# Altium schematic sheet motordriverschematic.SchDoc
size C; SheetNumber: 1; SheetTotal: 1
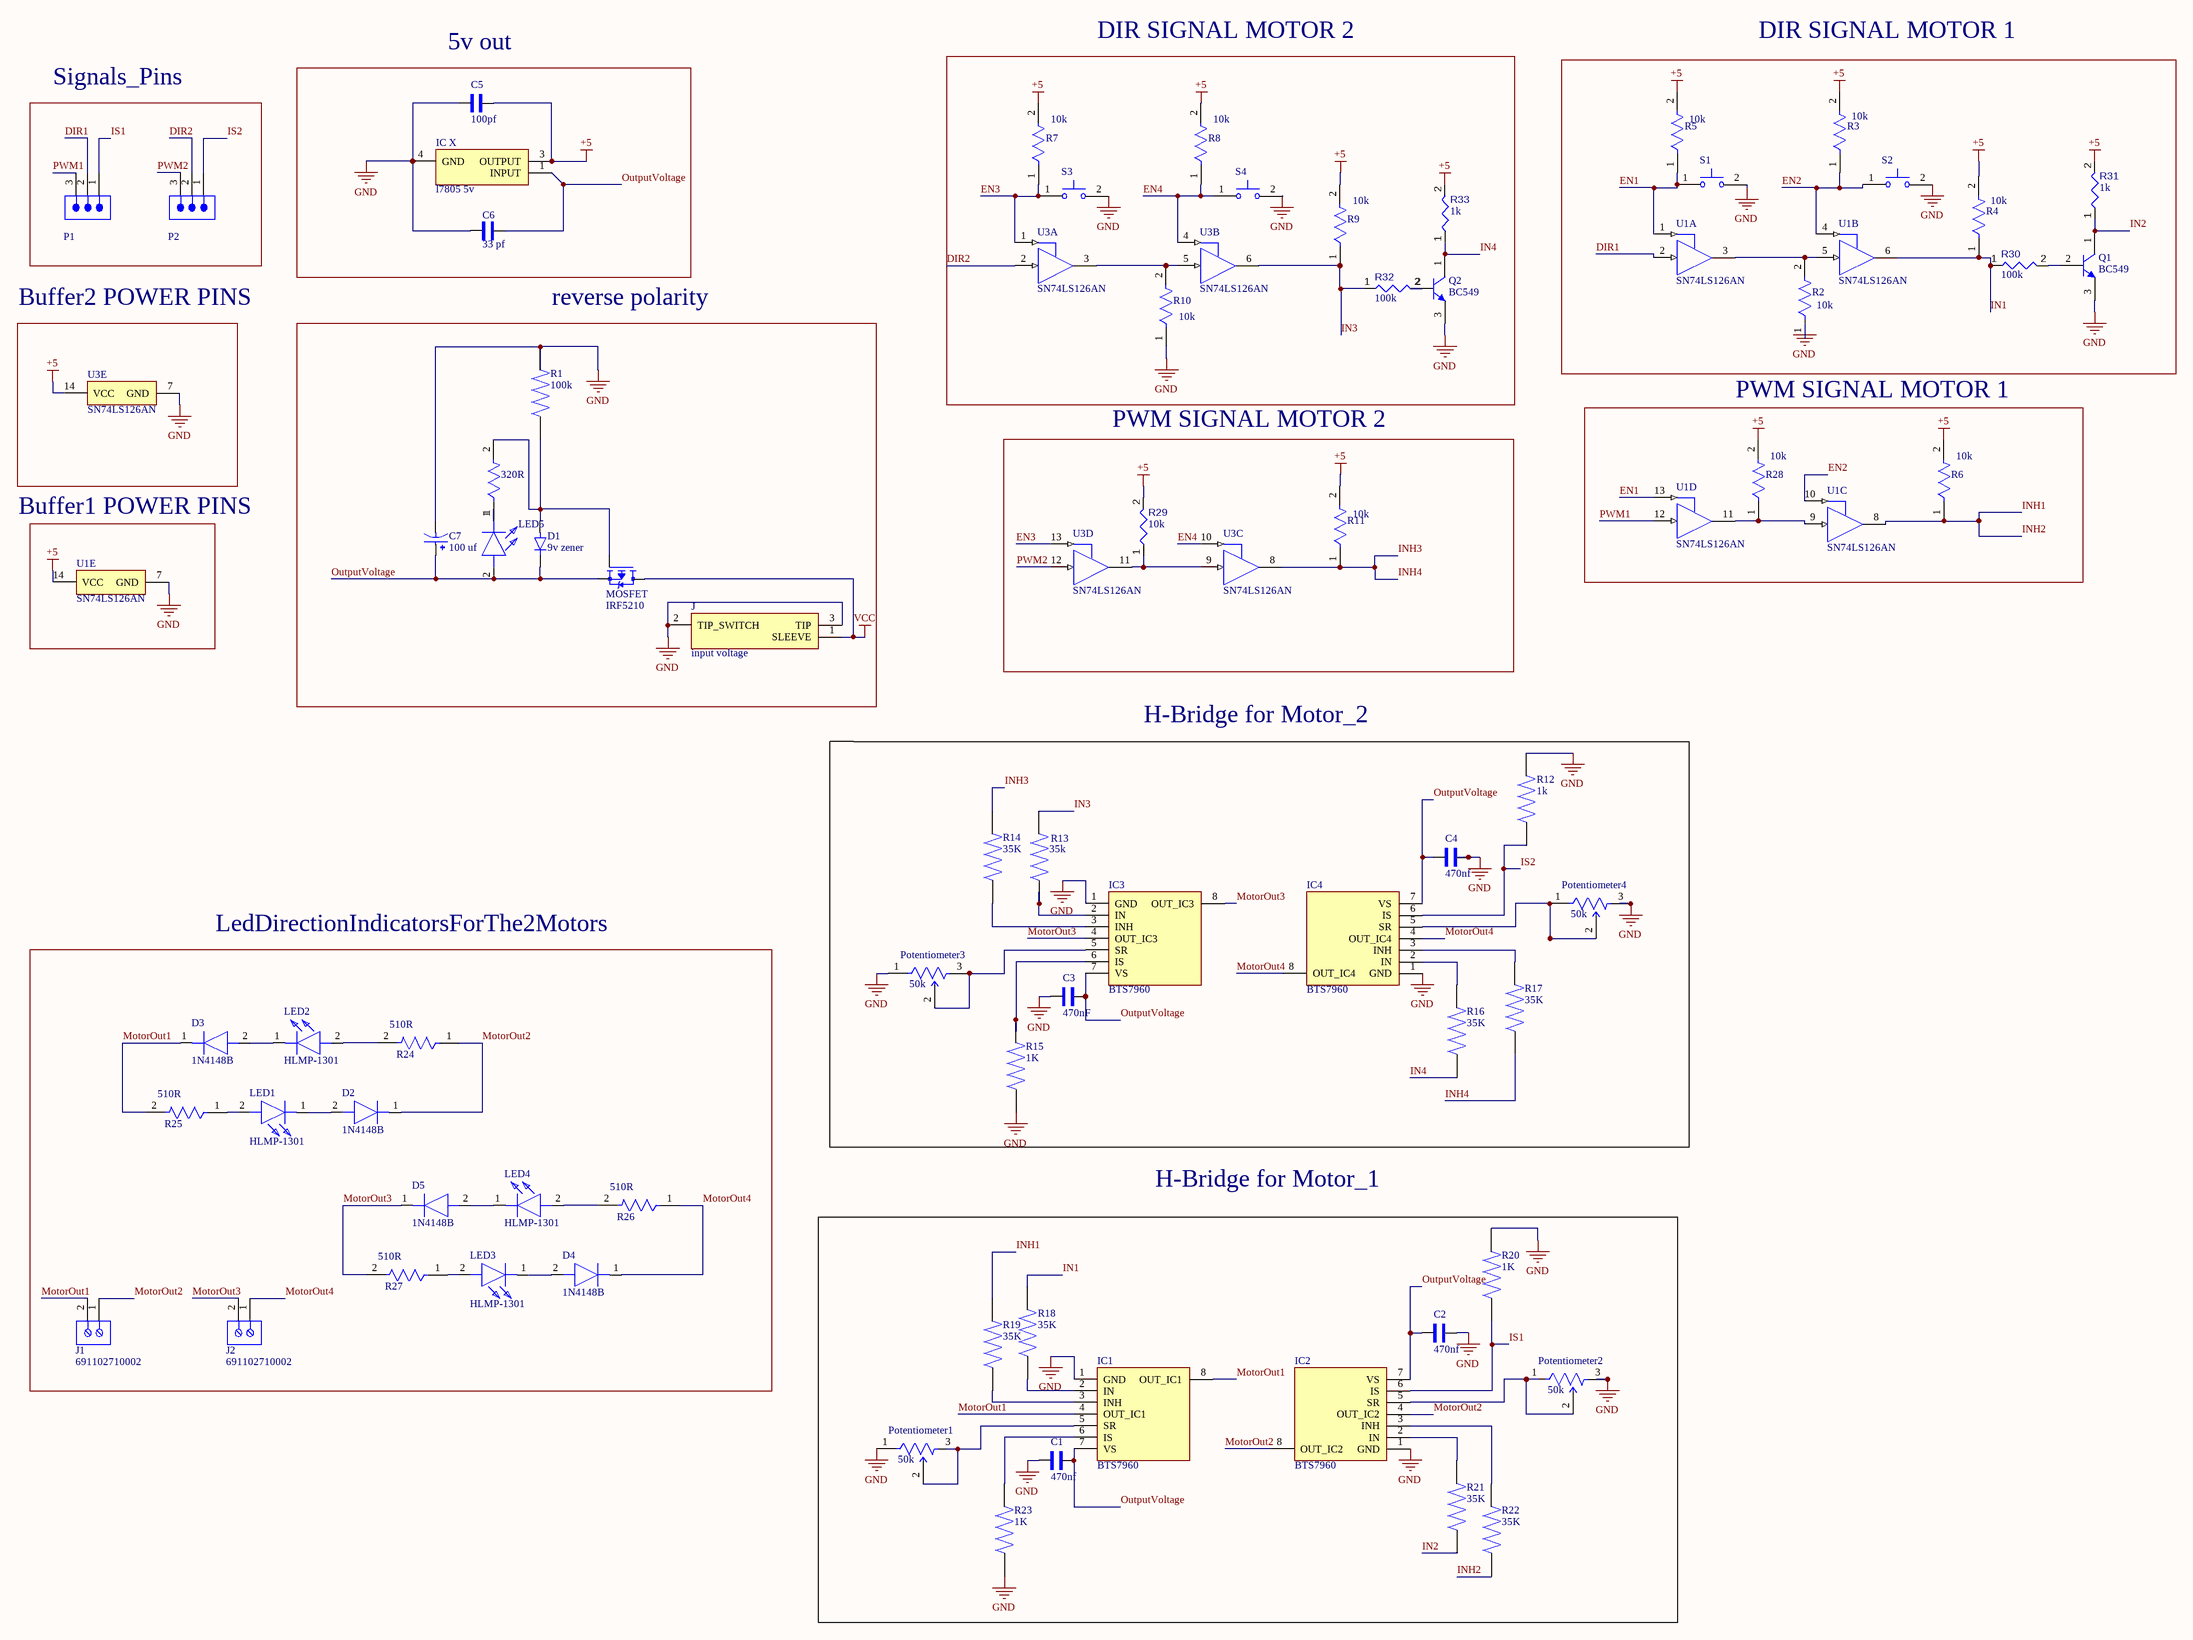
[diagram p0: motordriverschematic.SchDoc]

## Parts
320R  CF18JT10K0  [10k resistor]  (value not drawn)
C1  470nf  [CAPRR254W54L381T254H466]
C2  470nf  [CAPRR254W54L381T254H466]
C3  470nF  [CAPRR254W54L381T254H466]
C4  470nf  [CAPRR254W54L381T254H466]
C5  100pf  [CAPRR254W54L381T254H466]
C6  33 pf  [CAPRR254W54L381T254H466]
C7  100 uf  [CAPPRD750W80D1600H2000]
D1  9v zener  [DIOAD780W78L463D236]
D2  1N4148B  [DIOAD990W55L340D162]
D3  1N4148B  [DIOAD990W55L340D162]
D4  1N4148B  [DIOAD990W55L340D162]
D5  1N4148B  [DIOAD990W55L340D162]
IC1  BTS7960  [BTS7960B]
IC2  BTS7960  [BTS7960B]
IC3  BTS7960  [BTS7960B]
IC4  BTS7960  [BTS7960B]
IC_X  l7805 5v  [D2PAK-STB35NF10T4]
J  input voltage  [FC681465P]
J1  691102710002  [691102710002]
J2  691102710002  [691102710002]
LED1  HLMP-1301  [HLMP1301]
LED2  HLMP-1301  [HLMP1301]
LED3  HLMP-1301  [HLMP1301]
LED4  HLMP-1301  [HLMP1301]
LED5  HLMP-1301  [HLMP1301]  (value not drawn)
MOSFET  IRF5210  [TO254P1054X469X2933-3]
P1  691311700103  [691311700103]  (value not drawn)
P2  691311700103  [691311700103]  (value not drawn)
Potentiometer1  50k  [FP-3362U-MFG]
Potentiometer2  50k  [FP-3362U-MFG]
Potentiometer3  50k  [FP-3362U-MFG]
Potentiometer4  50k  [FP-3362U-MFG]
Q1  BC549  [ONSC-TO-92-3-29-04_AD]
Q2  BC549  [ONSC-TO-92-3-29-04_AD]
R1  100k  [RESAD1100W55L680D260]
R2  10k  [10k resistor]
R3  10k  [10k resistor]
R4  10k  [10k resistor]
R5  10k  [10k resistor]
R6  10k  [10k resistor]
R7  10k  [10k resistor]
R8  10k  [10k resistor]
R9  10k  [10k resistor]
R10  10k  [10k resistor]
R11  10k  [10k resistor]
R12  1k  [RESAD1100W55L680D260]
R13  35k  [RESAD1100W55L680D260]
R14  35K  [RESAD1100W55L680D260]
R15  1K  [RESAD1100W55L680D260]
R16  35K  [RESAD1100W55L680D260]
R17  35K  [RESAD1100W55L680D260]
R18  35K  [RESAD1100W55L680D260]
R19  35K  [RESAD1100W55L680D260]
R20  1K  [RESAD1100W55L680D260]
R21  35K  [RESAD1100W55L680D260]
R22  35K  [RESAD1100W55L680D260]
R23  1K  [RESAD1100W55L680D260]
R24  510R  [10k resistor]
R25  510R  [10k resistor]
R26  510R  [10k resistor]
R27  510R  [10k resistor]
R28  10k  [RESAD1100W55L680D260]
R29  value 10k  [RESA60-630X240]  (hidden comment: MFR-25FBF52-22K1)
R30  value 100k  [RESA60-630X240]  (hidden comment: MFR-25FBF52-2K21)
R31  value 1k  [RESA60-630X240]  (hidden comment: MFR-25FBF52-2K21)
R32  value 100k  [RESA60-630X240]  (hidden comment: MFR-25FBF52-2K21)
R33  value 1k  [RESA60-630X240]  (hidden comment: MFR-25FBF52-2K21)
S1  BUTT-2  [SW_BUTT-2]  (value not drawn)
S2  BUTT-2  [SW_BUTT-2]  (value not drawn)
S3  BUTT-2  [SW_BUTT-2]  (value not drawn)
S4  BUTT-2  [SW_BUTT-2]  (value not drawn)
U1  SN74LS126AN  [3-stateBuffer]  (parts A,B,C,D,E of 5)
U3  SN74LS126AN  [3-stateBuffer]  (parts A,B,C,D,E of 5)

## Blocks framed on the sheet
5v out: C5 C6 IC_X
DIR SIGNAL MOTOR 2: Q2 R7-R10 R32 R33 S3 S4 U3
DIR SIGNAL MOTOR 1: Q1 R2-R5 R30 R31 S1 S2 U1
Signals_Pins: P1 P2
Buffer2 POWER PINS: U3
reverse polarity: 320R C7 D1 J LED5 MOSFET R1
PWM SIGNAL MOTOR 2: R11 R29 U3
PWM SIGNAL MOTOR 1: R6 R28 U1
H-Bridge for Motor_2: C3 C4 IC3 IC4 Potentiometer3 Potentiometer4 R12-R17
LedDirectionIndicatorsForThe2Motors: D2-D5 J1 J2 LED1-LED4 R24-R27

## Nets
+5: C5.2 IC_X.3(OUTPUT) R3.2 R4.2 R5.2 R6.2 R7.2 R8.2 R9.2 R11.2 R28.2 R29.2 R31.2 R33.2 U1.14(VCC) U3.14(VCC)
GND: C1.1 C2.2 C3.1 C4.2 C5.1 C6.2 C7.N IC1.1(GND) IC2.1(GND) IC3.1(GND) IC4.1(GND) IC_X.4(GND) J.2(TIP_SWITCH) J.3(TIP) Potentiometer1.1(CCW) Potentiometer2.3(CW) Potentiometer3.1(CCW) Potentiometer4.3(CW) Q1.3(E) Q2.3(E) R1.2 R2.1 R10.1 R12.2 R15.1 R20.2 R23.1 S1.2 S2.2 S3.2 S4.2 U1.7(GND) U3.7(GND)
VCC: J.1(SLEEVE) MOSFET.2(D)
DIR1: P1.2 U1.2(1A)
DIR2: P2.2 U3.2(1A)
EN1: R5.1 S1.1 U1.1(1G) U1.13(4G)
EN2: R3.1 S2.1 U1.4(2G) U1.10(3G)
EN3: R7.1 S3.1 U3.1(1G) U3.13(4G)
EN4: R8.1 S4.1 U3.4(2G) U3.10(3G)
IN1: R4.1 R18.2 R30.1 U1.6(2Y)
IN2: Q1.1(C) R21.1 R31.1
IN3: R9.1 R13.2 R32.1 U3.6(2Y)
IN4: Q2.1(C) R16.1 R33.1
INH1: R6.1 R19.2 R22.1 U1.8(3Y)  [also labelled INH2]
INH3: R11.1 R14.2 R17.1 U3.8(3Y)  [also labelled INH4]
IS1: IC2.6(IS) P1.1 R20.1
IS2: IC4.6(IS) P2.1 R12.1
MotorOut1: D3.1(K) IC1.4(OUT_IC1) IC1.8(OUT_IC1) J1.2 R25.2
MotorOut2: D2.1(K) IC2.4(OUT_IC2) IC2.8(OUT_IC2) J1.1 R24.1
MotorOut3: D5.1(K) IC3.4(OUT_IC3) IC3.8(OUT_IC3) J2.2 R27.2
MotorOut4: D4.1(K) IC4.4(OUT_IC4) IC4.8(OUT_IC4) J2.1 R26.1
OutputVoltage: C1.2 C2.1 C3.2 C4.1 C6.1 C7.P D1.K IC1.7(VS) IC2.7(VS) IC3.7(VS) IC4.7(VS) IC_X.1(INPUT) LED5.2(A) MOSFET.3(S)
PWM1: P1.3 U1.12(4A)
PWM2: P2.3 U3.12(4A)
Net320R_1: 320R.1 LED5.1(K)
Net320R_2: 320R.2 D1.A MOSFET.1(G) R1.1
NetD2_2: D2.2(A) LED1.1(K)
NetD3_2: D3.2(A) LED2.1(K)
NetD4_2: D4.2(A) LED3.1(K)
NetD5_2: D5.2(A) LED4.1(K)
NetIC1_2: IC1.2(IN) R18.1
NetIC1_3: IC1.3(INH) R19.1
NetIC1_5: IC1.5(SR) Potentiometer1.2(WIPER) Potentiometer1.3(CW)
NetIC1_6: IC1.6(IS) R23.2
NetIC2_2: IC2.2(IN) R21.2
NetIC2_3: IC2.3(INH) R22.2
NetIC2_5: IC2.5(SR) Potentiometer2.1(CCW) Potentiometer2.2(WIPER)
NetIC3_2: IC3.2(IN) R13.1
NetIC3_3: IC3.3(INH) R14.1
NetIC3_5: IC3.5(SR) Potentiometer3.2(WIPER) Potentiometer3.3(CW)
NetIC3_6: IC3.6(IS) R15.2
NetIC4_2: IC4.2(IN) R16.2
NetIC4_3: IC4.3(INH) R17.2
NetIC4_5: IC4.5(SR) Potentiometer4.1(CCW) Potentiometer4.2(WIPER)
NetLED1_2: LED1.2(A) R25.1
NetLED2_2: LED2.2(A) R24.2
NetLED3_2: LED3.2(A) R27.1
NetLED4_2: LED4.2(A) R26.2
NetQ1_2: Q1.2(B) R30.2
NetQ2_2: Q2.2(B) R32.2
NetR2_2: R2.2 U1.3(1Y) U1.5(2A)
NetR10_2: R10.2 U3.3(1Y) U3.5(2A)
NetR28_1: R28.1 U1.9(3A) U1.11(4Y)
NetR29_1: R29.1 U3.9(3A) U3.11(4Y)

## Notes on the sheet
- Buffer1 POWER PINS
- H-Bridge for Motor_1

## Library data of the parts
320R = CMP-26528-000002-1: RES 10K OHM 1/8W 5% CF AXIAL; Manufacturer: Stackpole Electronics; Power Rating: 0.125W; Temperature Coefficient: 0-500ppm/°C; Resistance: 10kΩ; Voltage Rating: 250V; Value: 10kΩ; Temperature: -55°C to +155°C; Height: 2mm; Lead Free: Yes; Automotive: No; Device Class L2: Resistors; Package: CF18; Series: CF; ComponentLink2Description: Datasheet; Ipc Land Pattern Name: RESAD656W65L360D200; Manufacturer Part Number: CF18JT10K0; Temperature Range High: +155°C; RoHS: TRUE; Device Class L3: Through-Hole Resistors; Temperature Range Low: -55°C; Device Class L1: Passive Components; Category: Res; Octopart: https://octopart.com/cf18jt10k0-stackpole+electronics-19205642; Composition: Carbon Film; Digikey Description: RES 10K OHM 1/8W 5% CF AXIAL; ComponentLink2URL: http://www.seielect.com/Catalog/SEI-CF_CFM.pdf; Tolerance: 5%
C1-C6 = C315C470J1G5TA: Capacitor: ceramic; MLCC, monolithic; 47pF; 100V; C0G; Â±5%; THT; MF: KEMET; SnapEDA_Link: https://www.snapeda.com/parts/C315C470J1G5TA/KEMET/view-part/?ref=snap; Package: Radial Kemet; Value: *; MP: C315C470J1G5TA; Check_prices: https://www.snapeda.com/parts/C315C470J1G5TA/KEMET/view-part/?ref=eda
C7 = EEUFS1J681S: CAP ALUM 680UF 20% 63V THRU HOLE; MP: EEU-FS1J681S; MF: Panasonic Electronic Components; Package: RADIAL-2 Panasonic; Availability: In Stock; SnapEDA_Link: https://www.snapeda.com/parts/EEU-FS1J681S/Panasonic/view-part/5562022/?ref=snap; Price: None; Check_prices: https://www.snapeda.com/parts/EEU-FS1J681S/Panasonic/view-part/5562022/?ref=eda; Value: *
D1 = 1N4007-T: Diode Standard 1A 1000V 1Vf DO41 | Diodes Inc 1N4007-T; MF: Diodes Incorporated; SnapEDA_Link: https://www.snapeda.com/parts/1N4007-T/Diodes+Inc./view-part/?ref=snap; Package: DO-41 Diodes Inc.; Value: *; MP: 1N4007-T; Check_prices: https://www.snapeda.com/parts/1N4007-T/Diodes+Inc./view-part/?ref=eda
D2-D5 = 1N4148B: Diode; Manufacturer_Name: Vishay; Datasheet Link: https://www.vishay.com/docs/81857/1n4148.pdf; Manufacturer_Part_Number: 1N4148B
IC1-IC4 = BTS7960BNTMA1: Integrated Circuit; Manufacturer_Name: Infineon; Datasheet Link: https://www.mouser.co.uk/ProductDetail/Infineon-Technologies/BTS7960BNTMA1?qs=3%2FhYFTG7CVfEx3XLwpC3gw==; Height: 4.4mm; Manufacturer_Part_Number: BTS7960BNTMA1; Mouser Part Number: N/A; Mouser Price/Stock: https://www.mouser.co.uk/ProductDetail/Infineon-Technologies/BTS7960BNTMA1?qs=3%2FhYFTG7CVfEx3XLwpC3gw%3D%3D
IC_X = L7805ABD2T-TR: Integrated Circuit; Manufacturer_Name: STMicroelectronics; Datasheet Link: https://www.st.com/resource/en/datasheet/l78.pdf; Manufacturer_Part_Number: L7805ABD2T-TR; Mouser Part Number: 511-L7805ABD2T-TR; Mouser Price/Stock: https://www.mouser.co.uk/ProductDetail/STMicroelectronics/L7805ABD2T-TR?qs=LL%252BsqOK9SqOQ%2FfZD5ZsNqA%3D%3D; Arrow Part Number: L7805ABD2T-TR; Arrow Price/Stock: https://www.arrow.com/en/products/l7805abd2t-tr/stmicroelectronics?region=nac
J = FC681465P: Connector; Manufacturer_Name: CLIFF ELECTRONIC COMPONENTS; Datasheet Link: http://www.farnell.com/datasheets/2286781.pdf; Height: 11mm; Manufacturer_Part_Number: FC681465P
J1 J2 = CMP-1502-03258-2: NexarPartId: 8917706; Number of Levels: 1; Number of Positions Per Level: 2; Current: 15A; Voltage: 300V; Pitch: 5.0038mm; Plating: Steel; Stripping Length: -6mm; Wire Gauge (Min): 14AWG; Wire Gauge (Max): 22AWG; Length: 7.5mm; Contact Material: Brass; Contact Plating: Tin; Packaging: Box; Number of Pins: 2; Voltage Rating: 300V; Termination: Screw; Number of Contacts: 2; Color: Blue; Current Rating: 15A; Mount: Through Hole; Max Operating Temperature: 105°C; Min Operating Temperature: -40°C; REACH SVHC: Unknown; Height: 13.4mm; Width: 11.2mm; Housing Material: Nylon; RoHS: Compliant; Wire/Cable Gauge: 22AWG; Lead Pitch: 5mm
  J2: ComponentLink1Description: New link; ComponentLink1URL: *
LED1-LED5 = HLMP-1301: LED; Manufacturer_Name: Avago Technologies; Datasheet Link: https://componentsearchengine.com/Datasheets/2/HLMP-1301.pdf; Height: 6.35mm; Manufacturer_Part_Number: HLMP-1301; Mouser Part Number: 630-HLMP-1301; Mouser Price/Stock: https://www.mouser.co.uk/ProductDetail/Broadcom-Avago/HLMP-1301?qs=jT9z6tsiFNkJAuA0Y2YdzA%3D%3D; Arrow Part Number: HLMP-1301; Arrow Price/Stock: https://www.arrow.com/en/products/hlmp-1301/broadcom-limited
MOSFET = IRF5210: P-Channel 100V 38A _Tc_ 3.1W _Ta_, 170W _Tc_ Surface Mount D2PAK; MF: Infineon Technologies; SnapEDA_Link: https://www.snapeda.com/parts/IRF5210/Infineon%20Technologies/view-part/2777330/?ref=snap; Price: None; MP: IRF5210; Value: *; Availability: Unavailable; Package: TO-220 Infineon Technologies
P1 P2 = CMP-1502-02034-2: NexarPartId: 18818311; Number of Contacts: 3; Connector Type: PCB, Terminal Block; Pitch: 5.0038mm; Current: 20A; Gender: Male; Number of Levels: 1; Voltage: 300V; RoHS: Compliant; Number of Rows: 1; Color: Green; Length: 8.5mm; Number of Positions Per Level: 3; Termination: Solder; Mount: Through Hole; Contact Material: Brass; Lead Pitch: 5mm; Width: 17mm; Number of Pins: 3; Height: 12mm; REACH SVHC: Unknown; Orientation: Vertical; Packaging: Box; Contact Gender: Male
Potentiometer1-Potentiometer4 = CMP-07234-000033-1: TRIMMER 200K OHM 0.5W PC PIN TOP; Max Power Dissipation: 500mW; Temperature Coefficient: 100ppm/°C; Tolerance: 10%; Voltage Rating (DC): 300V; Resistance: 200kR; Package Quantity: 50; Length: 6.6mm; Lead Free: Lead Free; Technology: CERMET; RoHS Compliant: Yes; Max Operating Temperature: 125°C; Military Standard: Not; Packaging: Rail/Tube; Depth: 6.99mm; Mount: Through Hole; Termination: Pin; Color: Blue; Width: 0.26inch; Height: 0.185inch; Taper: Linear; Min Operating Temperature: -55°C; Weight: 0.02oz; Power Rating: 500mW; Series: Trimpot® 3362 - Sealed; Contact Plating: Tin; Resistor Type: Cermet
Q1 Q2 = CMP-1048-01363-1: Low Noise Transistor, NPN Silicon, 3-Pin TO-92, Pb-Free, Bulk Box; Manufacturer: On Semiconductor; PartNumber: BC549CG; IC Continuous (A): 0.1; RoHS: TRUE; Mounting Technology: Through Hole; ComponentLink3URL: http://www.onsemi.com/pub_link/Collateral/BC549B-D.PDF; PackageDescription: 3-Pin Transistor Outline, Body 4.825 x 3.685 mm, Pitch 1.27 mm; DatasheetVersion: Rev. AD; ComponentLink3Description: Package Specification; ComponentLink1URL: http://www.onsemi.com/; PackageVersion: Rev. AD; Polarity: NPN; ComponentLink2Description: Datasheet; ComponentLink1Description: Manufacturer URL; Packing: Bulk Box; ComponentLink2URL: http://www.onsemi.com/pub_link/Collateral/BC549B-D.PDF; PackageReference: TO-92-3-29-04_AD
R1 R12-R23 = MFR-25FBF52-1K: 1.07 kOhms Â±1% 0.25W, 1/4W Through Hole Resistor Axial - Metal Film; MF: Yageo; Value: *; SnapEDA_Link: https://www.snapeda.com/parts/MFR-25FBF52-1K/Yageo/view-part/?ref=snap; Purchase-URL: https://pricing.snapeda.com/search/part/MFR-25FBF52-1K/?ref=eda; Availability: In Stock; Price: None; Package: Axial Yageo; Check_prices: https://www.snapeda.com/parts/MFR-25FBF52-1K/Yageo/view-part/?ref=eda; MP: MFR-25FBF52-1K
R2-R11 R24-R28 = CMP-26528-000002-1: RES 10K OHM 1/8W 5% CF AXIAL; Manufacturer Part Number: CF18JT10K0; Manufacturer: Stackpole Electronics; Power Rating: 0.125W; Temperature Coefficient: 0-500ppm/°C; Resistance: 10kΩ; Voltage Rating: 250V; Value: 10kΩ; Temperature: -55°C to +155°C; Height: 2mm; Lead Free: Yes; Automotive: No; Device Class L2: Resistors; Package: CF18; Series: CF; ComponentLink2Description: Datasheet; Ipc Land Pattern Name: RESAD656W65L360D200; Temperature Range High: +155°C; RoHS: TRUE; Device Class L3: Through-Hole Resistors; Temperature Range Low: -55°C; Device Class L1: Passive Components; Category: Res; Octopart: https://octopart.com/cf18jt10k0-stackpole+electronics-19205642; Composition: Carbon Film; Digikey Description: RES 10K OHM 1/8W 5% CF AXIAL; ComponentLink2URL: http://www.seielect.com/Catalog/SEI-CF_CFM.pdf; Tolerance: 5%
R29 = CMP-009-00052-4: Axial Resistor, 22.1 KOhm, +/- 1%, 0.25 W, -55 to 155 degC, 2-Pin THD, RoHS, Bulk; Manufacturer: Yageo; Power: 250mW; Voltage Rating: 250V; Packaging: Bulk; Max Operating Temperature: 155°C; Case/Package: Axial; Tolerance: 1%; Mounting Technology: TH; Min Operating Temperature: -55°C; RoHS Compliant: True; Package Quantity: 200; Package Reference: MFR-25; Manufacturer URL: http://www.yageo.com/; Package Description: 2-Pin Axial Lead, Dia 2.4 mm, Body Length 6.3 mm; Datasheet Version: Apr-13; Datasheet URL: http://www.yageo.com/documents/recent/Yageo%20LR_MFR_2013.pdf
R30-R33 = CMP-009-00054-4: Axial Resistor, 2.21 KOhm, +/- 1%, 0.25 W, -55 to 155 degC, 2-Pin THD, RoHS, Bulk; Manufacturer: Yageo; Voltage Rating: 250V; Power: 250mW; Tolerance: 1%; Package Reference: MFR-25; Packaging: Bulk; Datasheet Version: Apr-13; Manufacturer URL: http://www.yageo.com/; Package Description: 2-Pin Axial Lead, Dia 2.4 mm, Body Length 6.3 mm; Mounting Technology: TH; RoHS Compliant: True; Package Quantity: 200; Min Operating Temperature: -55°C; Case/Package: Axial; Max Operating Temperature: 155°C; Datasheet URL: http://www.yageo.com/documents/recent/Yageo%20LR_MFR_2013.pdf
S1-S4 = BUTT-2: Tactile Switches MINI PUSH BUTTON SWITCH 2-PIN QTY. 4; MF: Gravitech; Purchase-URL: https://pricing.snapeda.com/search/part/BUTT-2/?ref=eda; Package: None; Value: *; Check_prices: https://www.snapeda.com/parts/BUTT-2/Gravitech/view-part/?ref=eda; SnapEDA_Link: https://www.snapeda.com/parts/BUTT-2/Gravitech/view-part/?ref=snap; Availability: In Stock; Price: None; MP: BUTT-2
U1 U3 = CMP-0440-00133-3: Quadruple Bus Buffer 3-State Outputs; Manufacturer: Texas Instruments; Rating: Catalog; VCC(Max)(V): 5.25; VCC(Min)(V): 4.75; ICC @ Nom Voltage(Max)(mA): 0.062; Bits(#): 4; Input Type: TTL; tpd @ Nom Voltage(Max)(ns): 18; F @ Nom Voltage(Max)(Mhz): 35; Voltage(Nom)(V): 5; Generic Part Number: SN74LS126A; DatasheetVersion: SDLS044A; Output Type: TTL; PackageVersion: http://www.ti.com/lit/ml/mpdi002c/mpdi002c.pdf; Operating Temperature Range(C): 0 to 70; PackageReference: N0014A; Code_JEDEC: MS-001